# EAGLE design ICSP-Breadboard-Header (EAGLE 7.5.0)
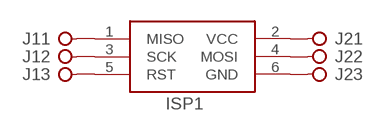
[diagram p0: schematic, sheet 1]

## Parts
ISP1  ICSP-HEADER-6  [ICSP-HEADER]
J1  PINHD-1X3  [1X03]
J2  PINHD-1X3  [1X03]

## Nets
N$1: ISP1.1(MISO) J1.1
N$2: ISP1.3(SCK) J1.2
N$3: ISP1.5(RST) J1.3
N$4: ISP1.2(VCC) J2.1
N$5: ISP1.4(MOSI) J2.2
N$6: ISP1.6(GND) J2.3

## Library data of the parts
ISP1 = SaintGimp:ICSP-HEADER: ICSP HEADER Standard 6 pin header for ICSP programming
J1 J2 = SaintGimp:PINHD-1X3: PIN HEADER

## Board
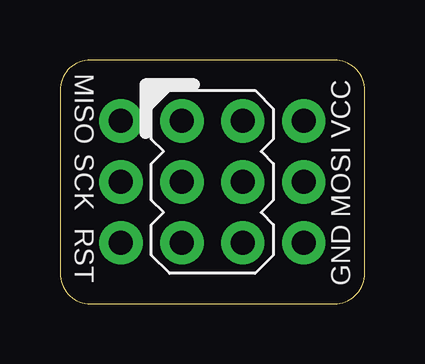
[diagram p1: board, top side]
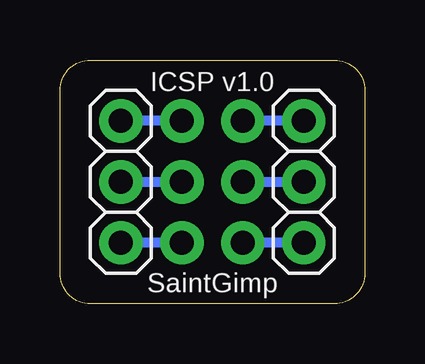
[diagram p2: board, bottom side, seen from below]

Size 12.7 x 10.16 mm. Coordinates in mm from the lower left corner, seen from the top.
Outline: 12.7,1.27 12.7,8.89 arc90 11.43,10.16 1.27,10.16 arc90 0,8.89 0,1.27 arc90 1.27,0 11.43,0 arc90 12.7,1.27
Copper layers (1*16): Top 0.0356mm / dielectric 1.5011mm / Bottom 0.0356mm
Design rules "Saintgimp-OSHPark": minimum track width 10mil, minimum drill 13mil, track to track 6mil, track to pad 6mil, pad to pad 6mil, via to via 6mil, smd to smd 6mil, copper to edge 15mil, drill to drill 6mil, minimum pad ring 12mil, minimum via ring 7mil, stop-mask expansion 2mil, vias tented up to drill 24mil, thermal gap 10mil

### Footprints (pad centres in the part's own frame; a part is rotated, then mirrored left to right if it is on the bottom)
ICSP-HEADER = drill 1: 1 -1.27,2.54; 2 1.27,2.54; 3 -1.27,0; 4 1.27,0; 5 -1.27,-2.54; 6 1.27,-2.54
1X03 = drill 1: 1 -2.54,0; 2 0,0; 3 2.54,0

### Placement (x,y rotation side)
ISP1  6.35,5.08 0 top
J1  2.54,5.08 270 bottom
J2  10.16,5.08 270 bottom

### Tracks (layer width: path | path; a pad name or v marks a point on that pad's centre or on a via)
N$1
  Bottom 0.406: J1.1 ISP1.1
N$2
  Bottom 0.406: ISP1.3 J1.2
N$3
  Bottom 0.406: J1.3 ISP1.5
N$4
  Bottom 0.406: ISP1.2 J2.1
N$5
  Bottom 0.406: J2.2 ISP1.4
N$6
  Bottom 0.406: ISP1.6 J2.3

### Text on the board
_tsilk: MISO | VCC | SCK | MOSI | RST | GND
_bsilk: ICSP v1.0 | SaintGimp